# Altium schematic sheet MSP430.SchDoc
size A
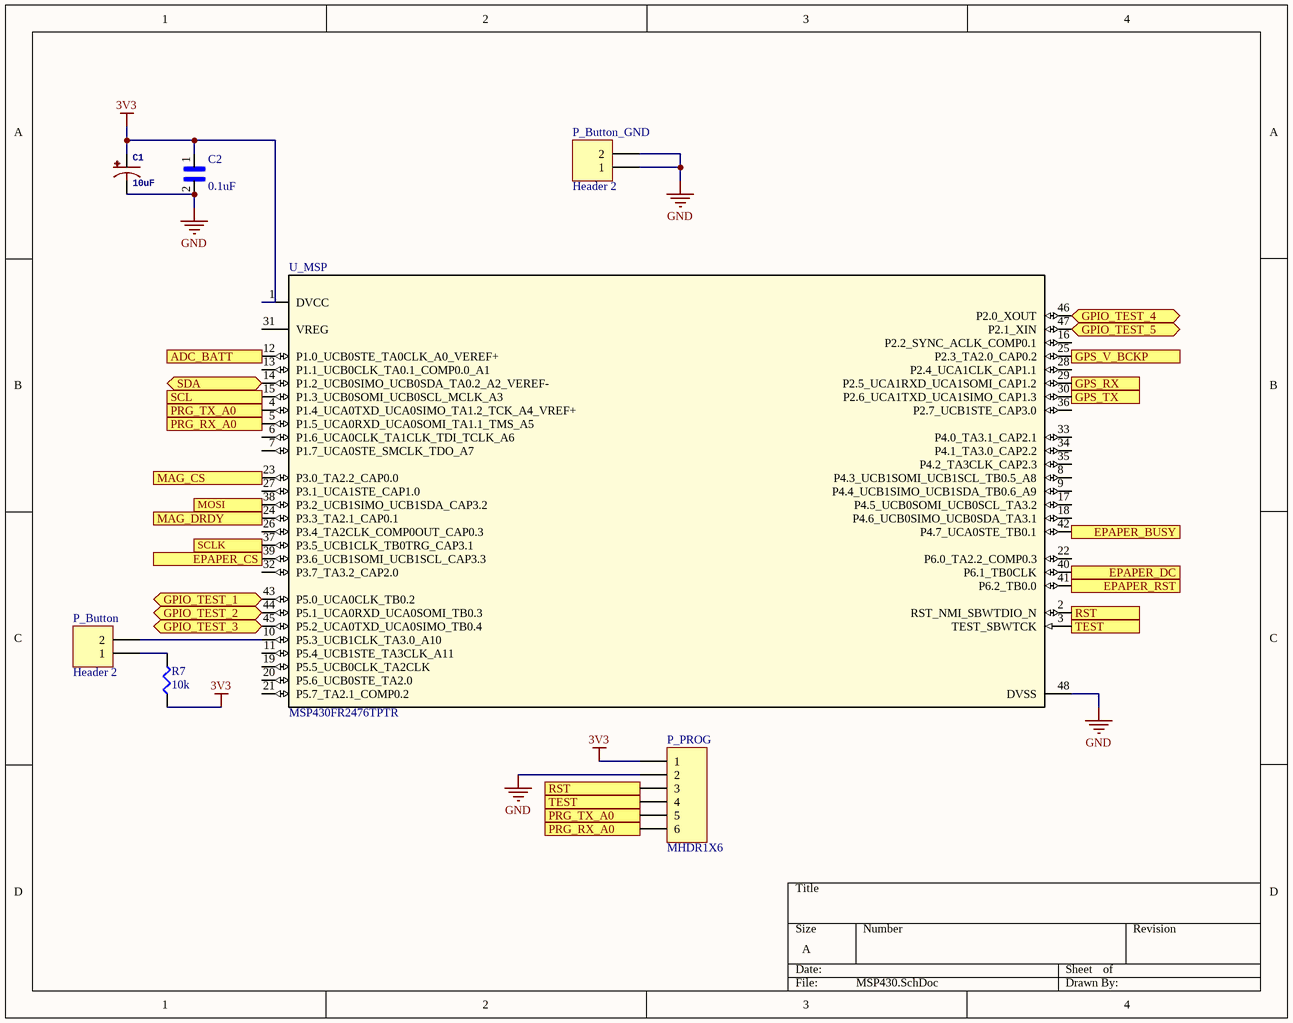
[diagram p0: MSP430.SchDoc]

## Parts
C1  10uF  [0603-POLAR]
C2  0.1uF  [*CAPC1608X90N]
P_Button  Header 2  [HDR1X2]
P_Button_GND  Header 2  [HDR1X2]
P_PROG  MHDR1X6  [MHDR1X6]
R7  10k  [SMD-0603-RES]
U_MSP  MSP430FR2476TPTR  [PT0048A_N]

## Ports
ADC_BATT (in), EPAPER_BUSY (out), EPAPER_CS (out), EPAPER_DC (out), EPAPER_RST (out), GPIO_TEST_1 (bidir), GPIO_TEST_2 (bidir), GPIO_TEST_3 (bidir), GPIO_TEST_4 (bidir), GPIO_TEST_5 (bidir), GPS_RX (in), GPS_TX (out), GPS_V_BCKP (out), MAG_CS (out), MAG_DRDY (out), MOSI (out), PRG_RX_A0 (in), PRG_RX_A0 (out), PRG_TX_A0 (in), PRG_TX_A0 (out), RST (in), RST (out), SCL (out), SCLK (out), SDA (bidir), TEST (in), TEST (out)

## Nets
3V3: C1.+ C2.1 P_PROG.1 R7.1 U_MSP.1(DVCC)
GND: C1.- C2.2 P_Button_GND.1 P_Button_GND.2 P_PROG.2 U_MSP.48(DVSS)
ADC_BATT: U_MSP.12(P1.0_UCB0STE_TA0CLK_A0_VEREF+) ; port ADC_BATT
EPAPER_BUSY: U_MSP.42(P4.7_UCA0STE_TB0.1) ; port EPAPER_BUSY
EPAPER_CS: U_MSP.39(P3.6_UCB1SOMI_UCB1SCL_CAP3.3) ; port EPAPER_CS
EPAPER_DC: U_MSP.40(P6.1_TB0CLK) ; port EPAPER_DC
EPAPER_RST: U_MSP.41(P6.2_TB0.0) ; port EPAPER_RST
GPIO_TEST_1: U_MSP.43(P5.0_UCA0CLK_TB0.2) ; port GPIO_TEST_1
GPIO_TEST_2: U_MSP.44(P5.1_UCA0RXD_UCA0SOMI_TB0.3) ; port GPIO_TEST_2
GPIO_TEST_3: U_MSP.45(P5.2_UCA0TXD_UCA0SIMO_TB0.4) ; port GPIO_TEST_3
GPIO_TEST_4: U_MSP.46(P2.0_XOUT) ; port GPIO_TEST_4
GPIO_TEST_5: U_MSP.47(P2.1_XIN) ; port GPIO_TEST_5
GPS_RX: U_MSP.29(P2.5_UCA1RXD_UCA1SOMI_CAP1.2) ; port GPS_RX
GPS_TX: U_MSP.30(P2.6_UCA1TXD_UCA1SIMO_CAP1.3) ; port GPS_TX
GPS_V_BCKP: U_MSP.25(P2.3_TA2.0_CAP0.2) ; port GPS_V_BCKP
MAG_CS: U_MSP.23(P3.0_TA2.2_CAP0.0) ; port MAG_CS
MAG_DRDY: U_MSP.24(P3.3_TA2.1_CAP0.1) ; port MAG_DRDY
MOSI: U_MSP.38(P3.2_UCB1SIMO_UCB1SDA_CAP3.2) ; port MOSI
PRG_RX_A0: P_PROG.6 U_MSP.5(P1.5_UCA0RXD_UCA0SOMI_TA1.1_TMS_A5) ; port PRG_RX_A0
PRG_TX_A0: P_PROG.5 U_MSP.4(P1.4_UCA0TXD_UCA0SIMO_TA1.2_TCK_A4_VREF+) ; port PRG_TX_A0
RST: P_PROG.3 U_MSP.2(RST_NMI_SBWTDIO_N) ; port RST
SCL: U_MSP.15(P1.3_UCB0SOMI_UCB0SCL_MCLK_A3) ; port SCL
SCLK: U_MSP.37(P3.5_UCB1CLK_TB0TRG_CAP3.1) ; port SCLK
SDA: U_MSP.14(P1.2_UCB0SIMO_UCB0SDA_TA0.2_A2_VEREF-) ; port SDA
TEST: P_PROG.4 U_MSP.3(TEST_SBWTCK) ; port TEST
NetP_Button_1: P_Button.1 R7.2
NetP_Button_2: P_Button.2 U_MSP.10(P5.3_UCB1CLK_TA3.0_A10)

Not connected (* = marked no-connect by the designer): U_MSP 6(P1.6_UCA0CLK_TA1CLK_TDI_TCLK_A6) 7(P1.7_UCA0STE_SMCLK_TDO_A7) 8(P4.3_UCB1SOMI_UCB1SCL_TB0.5_A8) 9(P4.4_UCB1SIMO_UCB1SDA_TB0.6_A9) 11(P5.4_UCB1STE_TA3CLK_A11) 13(P1.1_UCB0CLK_TA0.1_COMP0.0_A1) 16(P2.2_SYNC_ACLK_COMP0.1) 17(P4.5_UCB0SOMI_UCB0SCL_TA3.2) 18(P4.6_UCB0SIMO_UCB0SDA_TA3.1) 19(P5.5_UCB0CLK_TA2CLK) 20(P5.6_UCB0STE_TA2.0) 21(P5.7_TA2.1_COMP0.2) 22(P6.0_TA2.2_COMP0.3) 26(P3.4_TA2CLK_COMP0OUT_CAP0.3) 27(P3.1_UCA1STE_CAP1.0) 28(P2.4_UCA1CLK_CAP1.1) 31(VREG) 32(P3.7_TA3.2_CAP2.0) 33(P4.0_TA3.1_CAP2.1) 34(P4.1_TA3.0_CAP2.2) 35(P4.2_TA3CLK_CAP2.3) 36(P2.7_UCB1STE_CAP3.0)

## Library data of the parts
C1 = 10UF-POLAR-0603-6.3V-20%(TANT): GateName_1: G$1; SymbolName_1: CAP_POL; PROD_ID: CAP-13210; DeviceName: -0603-6.3V-20%(TANT); LibraryName: SparkFun-Capacitors; DeviceSetName: 10UF-POLAR; Package: 0603-POLAR
C2 = GMK107BJ104KAHT: CAP , MLCC , 0603, 35V , X5R, 0.1uF10% , T&R; MF: Taiyo Yuden; Package: 1608 Taiyo Yuden; Digi-Key_Purchase_URL: https://www.digikey.com/product-detail/en/taiyo-yuden/GMK107BJ104KAHT/587-3357-1-ND/4157244?utm_source=snapeda&utm_medium=aggregator&utm_campaign=symbol; Digi-Key_Part_Number: 587-3357-1-ND; SnapEDA_Link: https://www.snapeda.com/parts/GMK107BJ104KAHT/Taiyo%20Yuden/view-part/?ref=snap; MP: GMK107BJ104KAHT; Value: *
P_Button P_Button_GND = Header 2: Header, 2-Pin; LatestRevisionDate: 17-Jul-2002; LatestRevisionNote: Re-released for DXP Platform.; Publisher: Altium Limited
P_PROG = MHDR1X6: Header, 6-Pin; LatestRevisionDate: 17-Jul-2002; LatestRevisionNote: Re-released for DXP Platform.; Publisher: Altium Limited
R7 = ERJ-PA3F1002V: RES SMD 10K OHM 1% 1/4W 0603; Manufacturer: Panasonic Electronic Components; Factory Stock: 0; Unit Price (USD): 0.02372; @ qty: 1500; Minimum Quantity: 1; Power (Watts): 0.25W, 1/4W; Temperature Coefficient: ±100ppm/°C; Part Number: ERJ-PA3F1002V; Datasheets: https://industrial.panasonic.com/cdbs/www-data/pdf/RDA0000/AOA0000C243.pdf; Image: //media.digikey.com/Photos/Panasonic%20Photos/MFG_ERJ-P6W%20Series.jpg; Digi-Key Part Number: P10KBYCT-ND; Quantity Available: 12488; Packaging: Cut Tape (CT); Series: ERJ; Part Status: Active; Value: 10k; Tolerance: ±1%; Composition: Thick Film; Features: Automotive AEC-Q200, Pulse Withstanding; Operating Temperature: -55°C ~ 155°C; Package / Case: 0603 (1608 Metric); Supplier Device Package: 0603; Size / Dimension: 0.063" L x 0.031" W (1.60mm x 0.80mm); Height - Seated (Max): 0.022" (0.55mm); Number of Terminations: 2; Failure Rate: -
U_MSP = MSP430FR2476TPTR: Imported; Manufacturer: Texas Instruments; PartNumber: MSP430FR2476TPTR; RefDes: RefDes; TYPE: TYPE; Value: Value